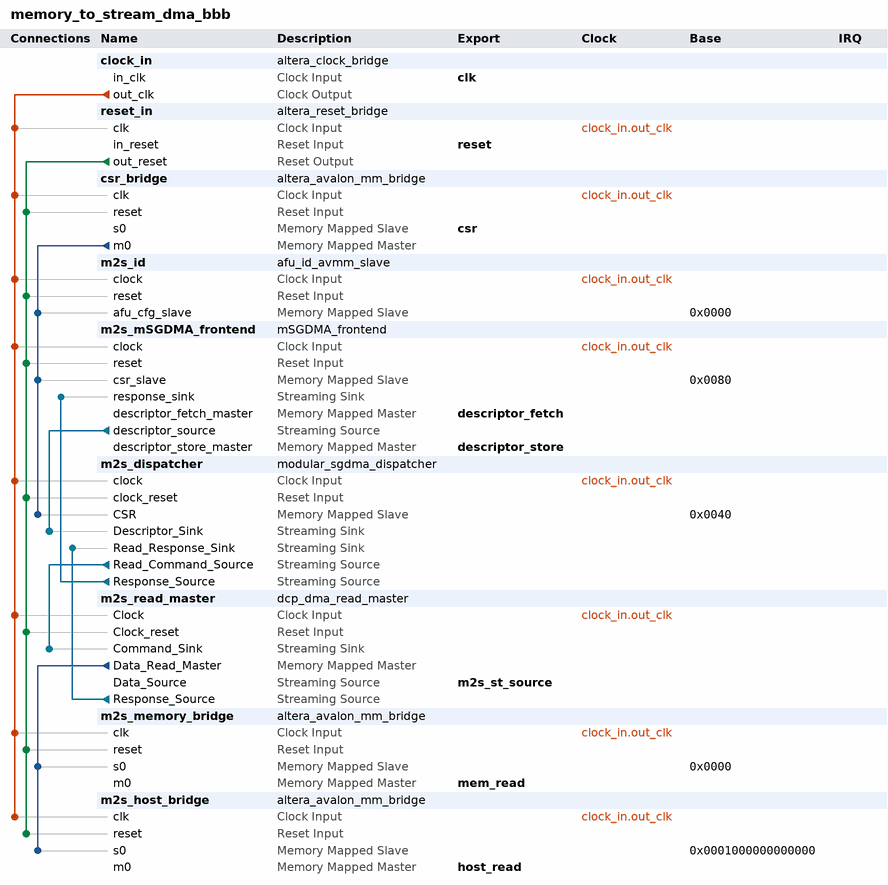
[diagram p0: system contents]
# Platform Designer (Qsys) system memory_to_stream_dma_bbb, Arria 10 10AX115N2F40E2LG
# Parameters at their usual value, and those the tool derives, are not listed.
package require -exact qsys 1.0
create_system memory_to_stream_dma_bbb
set_project_property DEVICE_FAMILY {Arria 10}
set_project_property DEVICE 10AX115N2F40E2LG

add_component clock_in ip/memory_to_stream_dma_bbb/memory_to_stream_dma_bbb_clock_in.ip altera_clock_bridge clock_in 17.1

add_component reset_in ip/memory_to_stream_dma_bbb/memory_to_stream_dma_bbb_reset_in.ip altera_reset_bridge reset_in 17.1

add_component csr_bridge ip/memory_to_stream_dma_bbb/memory_to_stream_dma_bbb_csr_bridge.ip altera_avalon_mm_bridge csr_bridge 17.1

add_component m2s_id ip/memory_to_stream_dma_bbb/memory_to_stream_dma_bbb_id.ip afu_id_avmm_slave m2s_id 1.0

add_component m2s_mSGDMA_frontend ip/memory_to_stream_dma_bbb/memory_to_stream_dma_bbb_mSGDMA_frontend.ip mSGDMA_frontend m2s_mSGDMA_frontend 1.0

add_component m2s_dispatcher ip/memory_to_stream_dma_bbb/memory_to_stream_dma_bbb_dispatcher.ip modular_sgdma_dispatcher m2s_dispatcher 17.1

add_component m2s_read_master ip/memory_to_stream_dma_bbb/memory_to_stream_dma_bbb_dma_read_master.ip dcp_dma_read_master m2s_read_master 17.1

add_component m2s_memory_bridge ip/memory_to_stream_dma_bbb/memory_to_stream_dma_bbb_memory_bridge.ip altera_avalon_mm_bridge m2s_memory_bridge 17.1

add_component m2s_host_bridge ip/memory_to_stream_dma_bbb/memory_to_stream_dma_bbb_host_bridge.ip altera_avalon_mm_bridge m2s_host_bridge 17.1

# connections
add_connection clock_in.out_clk csr_bridge.clk clock
add_connection clock_in.out_clk m2s_dispatcher.clock clock
add_connection clock_in.out_clk m2s_host_bridge.clk clock
add_connection clock_in.out_clk m2s_id.clock clock
add_connection clock_in.out_clk m2s_memory_bridge.clk clock
add_connection clock_in.out_clk m2s_mSGDMA_frontend.clock clock
add_connection clock_in.out_clk m2s_read_master.Clock clock
add_connection clock_in.out_clk reset_in.clk clock
add_connection reset_in.out_reset csr_bridge.reset reset
add_connection reset_in.out_reset m2s_dispatcher.clock_reset reset
add_connection reset_in.out_reset m2s_host_bridge.reset reset
add_connection reset_in.out_reset m2s_id.reset reset
add_connection reset_in.out_reset m2s_memory_bridge.reset reset
add_connection reset_in.out_reset m2s_mSGDMA_frontend.reset reset
add_connection reset_in.out_reset m2s_read_master.Clock_reset reset
add_connection csr_bridge.m0 m2s_dispatcher.CSR avalon
set_connection_parameter_value csr_bridge.m0/m2s_dispatcher.CSR baseAddress 0x0040
add_connection csr_bridge.m0 m2s_id.afu_cfg_slave avalon
set_connection_parameter_value csr_bridge.m0/m2s_id.afu_cfg_slave baseAddress 0x0000
add_connection csr_bridge.m0 m2s_mSGDMA_frontend.csr_slave avalon
set_connection_parameter_value csr_bridge.m0/m2s_mSGDMA_frontend.csr_slave baseAddress 0x0080
add_connection m2s_read_master.Data_Read_Master m2s_host_bridge.s0 avalon
set_connection_parameter_value m2s_read_master.Data_Read_Master/m2s_host_bridge.s0 baseAddress 0x0001000000000000
add_connection m2s_read_master.Data_Read_Master m2s_memory_bridge.s0 avalon
set_connection_parameter_value m2s_read_master.Data_Read_Master/m2s_memory_bridge.s0 baseAddress 0x0000
add_connection m2s_dispatcher.Read_Command_Source m2s_read_master.Command_Sink avalon_streaming
add_connection m2s_dispatcher.Response_Source m2s_mSGDMA_frontend.response_sink avalon_streaming
add_connection m2s_mSGDMA_frontend.descriptor_source m2s_dispatcher.Descriptor_Sink avalon_streaming
add_connection m2s_read_master.Response_Source m2s_dispatcher.Read_Response_Sink avalon_streaming

# exported interfaces
add_interface clk clock sink
set_interface_property clk EXPORT_OF clock_in.in_clk
add_interface csr avalon slave
set_interface_property csr EXPORT_OF csr_bridge.s0
add_interface descriptor_fetch avalon master
set_interface_property descriptor_fetch EXPORT_OF m2s_mSGDMA_frontend.descriptor_fetch_master
add_interface descriptor_store avalon master
set_interface_property descriptor_store EXPORT_OF m2s_mSGDMA_frontend.descriptor_store_master
add_interface host_read avalon master
set_interface_property host_read EXPORT_OF m2s_host_bridge.m0
add_interface m2s_st_source avalon_streaming source
set_interface_property m2s_st_source EXPORT_OF m2s_read_master.Data_Source
add_interface mem_read avalon master
set_interface_property mem_read EXPORT_OF m2s_memory_bridge.m0
add_interface reset reset sink
set_interface_property reset EXPORT_OF reset_in.in_reset

set_interconnect_requirement {$system} qsys_mm.clockCrossingAdapter HANDSHAKE
set_interconnect_requirement {$system} qsys_mm.enableEccProtection FALSE
set_interconnect_requirement {$system} qsys_mm.insertDefaultSlave FALSE
set_interconnect_requirement {$system} qsys_mm.maxAdditionalLatency 1

save_system memory_to_stream_dma_bbb.qsys
